# Altium project bailey-x.PrjPcb (part 8 of 8)
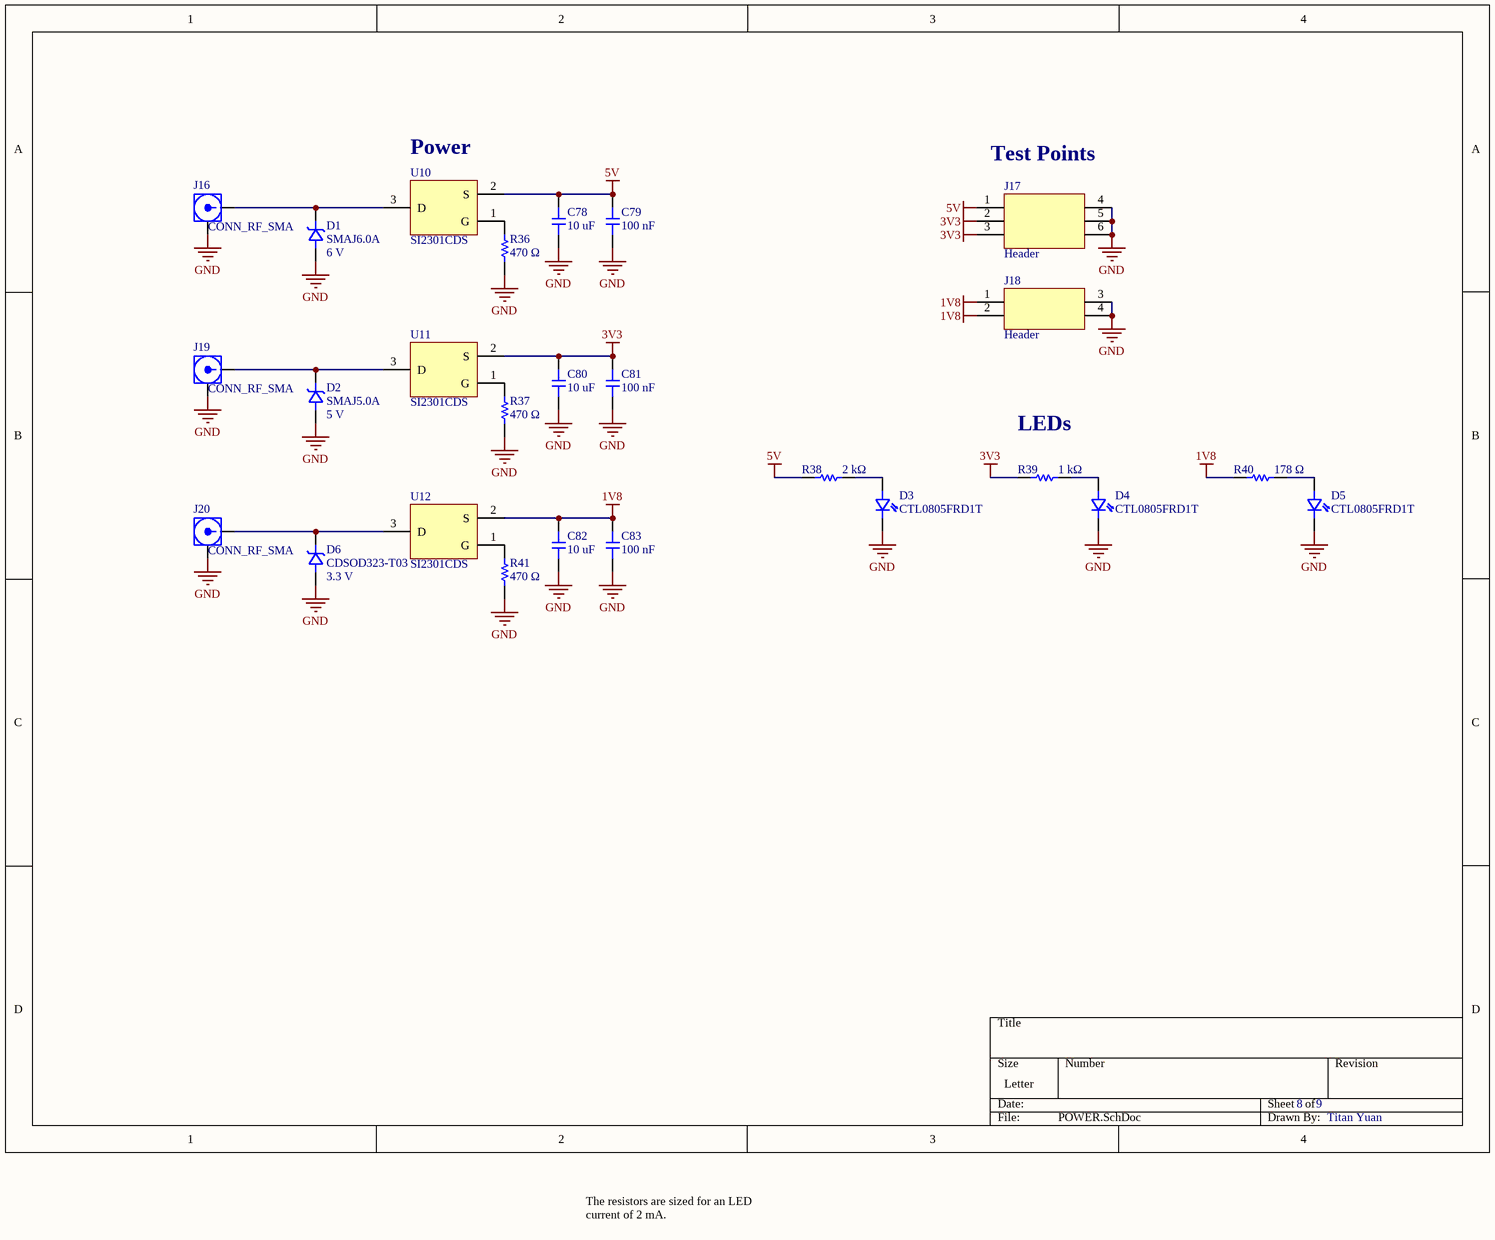
[diagram p14: POWER.SchDoc]

## Sheet POWER.SchDoc (continued)

### Library data of the parts (continued)
R39 = RES: 100mW Thick Film Resistors 75V ±100ppm/℃ ±1% 1kΩ 0603 Chip Resistor - Surface Mount ROHS; Manufacturer: Yageo; Manufacturer Part Number: RC0603FR-071KL; Temperature Coefficient: 100ppm/°C; Voltage Rating: 50V; Tolerance: 1%; Power Rating: *; Package Size: 0603; Supplier: DigiKey; Supplier Part Number: 311-1.00KHRCT-ND; RoHS: Compliant; Category: Chip SMD Resistors; Stock: 5944272; Pricing: 1=0.1, 10=0.008, 25=0.0076, 50=0.0072, 100=0.0061, 250=0.00568, 1000=0.00569, 5000=0.00204 (USD); Case/Package: 0603; Case Code (Imperial): 0603; Case Code (Metric): 0603; China RoHS: Non-Compliant; Composition: Thick Film; Contact Plating: Tin; Country of Origin: Mainland China, Taiwan; Depth: 800µm; Export Control Classification Number (ECCN) Code: EAR99; Height: 450µm; Harmonized Tariff Schedule (HTS) Code: 8533.21.00.30; Introduction Date: 2004-10-04; Lead Free: Lead Free; Length: 1.6mm; Lifecycle Status: Production; Max Operating Temperature: 155°C; Military Standard: Not; Min Operating Temperature: -55°C; Mounting Technology: Surface Mount; Pins: 2; Number of Terminals: 2; Packaging: Tape and Reel; Power Dissipation: 100mW; Radiation Hardening: No; REACH SVHC: Yes; Value: 1kΩ; Schedule B: 8533210045, 8533210045|8533210045|8533210045|8533210045|8533210045|8533210045|8533210045|8533210045|8533210045|8533210045|8533210045|8533210045|8533210045|8533210045|8533210045|8533210045|8533210045|8533210045|8533210045|8533210045|8533210045|8533210045|8533210045|85; Termination: SMD/SMT; Voltage Rating (DC): 50V; Width: 800µm; Working Voltage: 75V; ComponentLink1URL: https://datasheet.octopart.com:443/RC0603FR-071KL-Yageo-datasheet-175887523.pdf?src-supplier=Newark; ComponentLink1Description: https://datasheet.octopart.com:443/RC0603FR-071KL-Yageo-datasheet-175887523.pdf?src-supplier=Newark; ComponentLink2URL: https://datasheet.octopart.com:443/RC0603FR-071KL-Yageo-datasheet-34211833.pdf?src-supplier=Newark; ComponentLink2Description: https://datasheet.octopart.com:443/RC0603FR-071KL-Yageo-datasheet-34211833.pdf?src-supplier=Newark; ComponentLink3URL: https://datasheet.octopart.com:443/RC0603FR-071KL-Yageo-datasheet-12596169.pdf?src-supplier=Newark; ComponentLink3Description: https://datasheet.octopart.com:443/RC0603FR-071KL-Yageo-datasheet-12596169.pdf?src-supplier=Newark; ComponentLink4URL: https://datasheet.octopart.com:443/RC0603FR-071KL-Yageo-datasheet-499455.pdf?src-supplier=Newark; ComponentLink4Description: https://datasheet.octopart.com:443/RC0603FR-071KL-Yageo-datasheet-499455.pdf?src-supplier=Newark; ComponentLink5URL: https://datasheet.octopart.com:443/RC0603FR-071KL-Yageo-datasheet-503470.pdf?src-supplier=Newark; ComponentLink5Description: https://datasheet.octopart.com:443/RC0603FR-071KL-Yageo-datasheet-503470.pdf?src-supplier=Newark; ComponentLink6URL: https://datasheet.octopart.com:443/RC0603FR-071KL-Yageo-datasheet-62067350.pdf?src-supplier=element14+APAC; ComponentLink6Description: https://datasheet.octopart.com:443/RC0603FR-071KL-Yageo-datasheet-62067350.pdf?src-supplier=element14+APAC; ComponentLink7URL: https://datasheet.octopart.com:443/RC0603FR-071KL-Yageo-datasheet-21426514.pdf?src-supplier=element14+APAC; ComponentLink7Description: https://datasheet.octopart.com:443/RC0603FR-071KL-Yageo-datasheet-21426514.pdf?src-supplier=element14+APAC; ComponentLink8URL: https://datasheet.octopart.com:443/RC0603FR-071KL-Yageo-datasheet-141265859.pdf?src-supplier=Upverter; ComponentLink8Description: https://datasheet.octopart.com:443/RC0603FR-071KL-Yageo-datasheet-141265859.pdf?src-supplier=Upverter; ComponentLink9URL: https://datasheet.octopart.com:443/RC0603FR-071KL-Yageo-datasheet-103092701.pdf?src-supplier=Upverter; ComponentLink9Description: https://datasheet.octopart.com:443/RC0603FR-071KL-Yageo-datasheet-103092701.pdf?src-supplier=Upverter; ComponentLink10URL: https://sigma.octopart.com:443/138820526/technical_drawing/Yageo-RC0603FR-071KL.pdf?src-supplier=Upverter; ComponentLink10Description: https://sigma.octopart.com:443/138820526/technical_drawing/Yageo-RC0603FR-071KL.pdf?src-supplier=Upverter; ComponentLink11URL: https://datasheet.octopart.com:443/RC0603FR-071KL-Yageo-datasheet-68297981.pdf?src-supplier=Upverter; ComponentLink11Description: https://datasheet.octopart.com:443/RC0603FR-071KL-Yageo-datasheet-68297981.pdf?src-supplier=Upverter; ComponentLink12URL: https://datasheet.octopart.com:443/RC0603FR-071KL-Yageo-datasheet-8328172.pdf?src-supplier=Farnell; ComponentLink12Description: https://datasheet.octopart.com:443/RC0603FR-071KL-Yageo-datasheet-8328172.pdf?src-supplier=Farnell; ComponentLink13URL: https://datasheet.octopart.com:443/RC0603FR-071KL-Yageo-datasheet-13691069.pdf?src-supplier=Farnell; ComponentLink13Description: https://datasheet.octopart.com:443/RC0603FR-071KL-Yageo-datasheet-13691069.pdf?src-supplier=Farnell; ComponentLink14URL: https://datasheet.octopart.com:443/RC0603FR-071KL-Yageo-datasheet-15599030.pdf?src-supplier=Seeed+Studio; ComponentLink14Description: https://datasheet.octopart.com:443/RC0603FR-071KL-Yageo-datasheet-15599030.pdf?src-supplier=Seeed+Studio; ComponentLink15URL: https://datasheet.octopart.com:443/RC0603FR-071KL-Yageo-Group-datasheet-176638170.pdf?src-supplier=Future+Electronics; ComponentLink15Description: https://datasheet.octopart.com:443/RC0603FR-071KL-Yageo-Group-datasheet-176638170.pdf?src-supplier=Future+Electronics; ComponentLink16URL: https://datasheet.octopart.com:443/RC0603FR-071KL-Yageo-datasheet-164759695.pdf?src-supplier=Future+Electronics; ComponentLink16Description: https://datasheet.octopart.com:443/RC0603FR-071KL-Yageo-datasheet-164759695.pdf?src-supplier=Future+Electronics; ComponentLink17URL: https://datasheet.octopart.com:443/RC0603FR-071KL-Yageo-datasheet-137700087.pdf?src-supplier=Future+Electronics; ComponentLink17Description: https://datasheet.octopart.com:443/RC0603FR-071KL-Yageo-datasheet-137700087.pdf?src-supplier=Future+Electronics; ComponentLink18URL: https://datasheet.octopart.com:443/RC0603FR071KL-Yageo-datasheet-27584510.pdf?src-supplier=Future+Electronics; ComponentLink18Description: https://datasheet.octopart.com:443/RC0603FR071KL-Yageo-datasheet-27584510.pdf?src-supplier=Future+Electronics; ComponentLink19URL: https://datasheet.octopart.com:443/RC0603FR-071KL-Yageo-datasheet-8324193.pdf?src-supplier=Future+Electronics; ComponentLink19Description: https://datasheet.octopart.com:443/RC0603FR-071KL-Yageo-datasheet-8324193.pdf?src-supplier=Future+Electronics; ComponentLink20URL: https://datasheet.octopart.com:443/RC0603FR-071KL-Yageo-datasheet-79472498.pdf?src-supplier=Megastar; ComponentLink20Description: https://datasheet.octopart.com:443/RC0603FR-071KL-Yageo-datasheet-79472498.pdf?src-supplier=Megastar; ComponentLink21URL: https://datasheet.octopart.com/RC0603FR-071KL-Yageo-datasheet-73766026.pdf; ComponentLink21Description: https://datasheet.octopart.com/RC0603FR-071KL-Yageo-datasheet-73766026.pdf; ComponentLink22URL: https://datasheet.octopart.com:443/RC0603FR-071KL-Yageo-datasheet-118562.pdf?src-supplier=DigiKey; ComponentLink22Description: https://datasheet.octopart.com:443/RC0603FR-071KL-Yageo-datasheet-118562.pdf?src-supplier=DigiKey; ComponentLink23URL: http://sigma.octopart.com:80/conflict_mineral_statement/Yageo-company-3.pdf?src-supplier=Compliance+Statements; ComponentLink23Description: http://sigma.octopart.com:80/conflict_mineral_statement/Yageo-company-3.pdf?src-supplier=Compliance+Statements; ComponentLink24URL: http://sigma.octopart.com:80/rohs_statement/Yageo-company-2.pdf?src-supplier=Compliance+Statements; ComponentLink24Description: http://sigma.octopart.com:80/rohs_statement/Yageo-company-2.pdf?src-supplier=Compliance+Statements
R40 = RES: Res Thick Film 0603 178 Ohm 1% 0.1W(1/10W) ±100ppm/C Pad SMD T/R; Manufacturer: Yageo; Manufacturer Part Number: RC0603FR-07178RL; Power Dissipation: 100mW; Value: 178Ω; Temperature Coefficient: 100ppm/°C; Voltage Rating: 75V; Voltage Rating (DC): 50V; Tolerance: 1%; Power Rating: *; Package Size: 0603; Supplier: DigiKey; Supplier Part Number: 311-178HRCT-ND; RoHS: Compliant; Category: Chip SMD Resistors; Stock: 269039; Pricing: 1=0.1, 10=0.006, 25=0.0056, 50=0.0052 (USD); Case/Package: 0603; Case Code (Imperial): 0603; China RoHS: Non-Compliant; Composition: Thick Film; Depth: 800µm; Height: 450µm; Lead Free: Lead Free; Length: 1.6mm; Lifecycle Status: Production; Max Operating Temperature: 155°C; Military Standard: Not; Min Operating Temperature: -55°C; Mounting Technology: Surface Mount; Number of Terminals: 2; Packaging: Tape & Reel; REACH SVHC: Yes; Schedule B: 8533210045, 8533210045|8533210045|8533210045|8533210045|8533210045; Termination: SMD/SMT; Width: 800µm; Working Voltage: 75V; ComponentLink1URL: https://datasheet.octopart.com:443/RC0603FR-07178RL-Yageo-datasheet-175887523.pdf?src-supplier=Newark; ComponentLink1Description: https://datasheet.octopart.com:443/RC0603FR-07178RL-Yageo-datasheet-175887523.pdf?src-supplier=Newark; ComponentLink2URL: https://datasheet.octopart.com:443/RC0603FR-07178RL-Yageo-datasheet-103092701.pdf?src-supplier=Upverter; ComponentLink2Description: https://datasheet.octopart.com:443/RC0603FR-07178RL-Yageo-datasheet-103092701.pdf?src-supplier=Upverter; ComponentLink3URL: https://datasheet.octopart.com:443/RC0603FR-07178RL-Yageo-Group-datasheet-176638170.pdf?src-supplier=Future+Electronics; ComponentLink3Description: https://datasheet.octopart.com:443/RC0603FR-07178RL-Yageo-Group-datasheet-176638170.pdf?src-supplier=Future+Electronics; ComponentLink4URL: https://datasheet.octopart.com:443/RC0603FR-07178RL-Yageo-datasheet-164759695.pdf?src-supplier=Future+Electronics; ComponentLink4Description: https://datasheet.octopart.com:443/RC0603FR-07178RL-Yageo-datasheet-164759695.pdf?src-supplier=Future+Electronics; ComponentLink5URL: https://datasheet.octopart.com:443/RC0603FR-07178RL-Yageo-datasheet-137700087.pdf?src-supplier=Future+Electronics; ComponentLink5Description: https://datasheet.octopart.com:443/RC0603FR-07178RL-Yageo-datasheet-137700087.pdf?src-supplier=Future+Electronics; ComponentLink6URL: https://datasheet.octopart.com:443/RC0603FR-07178RL-Yageo-datasheet-101672632.pdf?src-supplier=Future+Electronics; ComponentLink6Description: https://datasheet.octopart.com:443/RC0603FR-07178RL-Yageo-datasheet-101672632.pdf?src-supplier=Future+Electronics; ComponentLink7URL: https://datasheet.octopart.com:443/RC0603FR-07178RL-Yageo-datasheet-15599030.pdf?src-supplier=Future+Electronics; ComponentLink7Description: https://datasheet.octopart.com:443/RC0603FR-07178RL-Yageo-datasheet-15599030.pdf?src-supplier=Future+Electronics; ComponentLink8URL: https://datasheet.octopart.com:443/RC0603FR-07178RL-Yageo-datasheet-12596169.pdf?src-supplier=Future+Electronics; ComponentLink8Description: https://datasheet.octopart.com:443/RC0603FR-07178RL-Yageo-datasheet-12596169.pdf?src-supplier=Future+Electronics; ComponentLink9URL: https://datasheet.octopart.com:443/RC0603FR-07178RL-Yageo-datasheet-8328172.pdf?src-supplier=Future+Electronics; ComponentLink9Description: https://datasheet.octopart.com:443/RC0603FR-07178RL-Yageo-datasheet-8328172.pdf?src-supplier=Future+Electronics; ComponentLink10URL: https://datasheet.octopart.com:443/RC0603FR-07178RL-Yageo-datasheet-148775077.pdf?src-supplier=TME; ComponentLink10Description: https://datasheet.octopart.com:443/RC0603FR-07178RL-Yageo-datasheet-148775077.pdf?src-supplier=TME; ComponentLink11URL: https://datasheet.octopart.com/RC0603FR-07178RL-Yageo-datasheet-73766026.pdf; ComponentLink11Description: https://datasheet.octopart.com/RC0603FR-07178RL-Yageo-datasheet-73766026.pdf; ComponentLink12URL: https://datasheet.octopart.com:443/RC0603FR-07178RL-Yageo-datasheet-118562.pdf?src-supplier=DigiKey; ComponentLink12Description: https://datasheet.octopart.com:443/RC0603FR-07178RL-Yageo-datasheet-118562.pdf?src-supplier=DigiKey; ComponentLink13URL: http://sigma.octopart.com:80/conflict_mineral_statement/Yageo-company-3.pdf?src-supplier=Compliance+Statements; ComponentLink13Description: http://sigma.octopart.com:80/conflict_mineral_statement/Yageo-company-3.pdf?src-supplier=Compliance+Statements; ComponentLink14URL: http://sigma.octopart.com:80/rohs_statement/Yageo-company-2.pdf?src-supplier=Compliance+Statements; ComponentLink14Description: http://sigma.octopart.com:80/rohs_statement/Yageo-company-2.pdf?src-supplier=Compliance+Statements
U10-U12 = SI2301CDS: P-ch Mosfet SOT-23 20V 112MOHM @ 4.5V - Lead(pb) And Halogen Free; Manufacturer: Vishay Siliconix; Manufacturer Part Number: SI2301CDS-T1-GE3; Continuous Drain Current (ID): 3.1A; Drain to Source Breakdown Voltage: -20V; Drain to Source Resistance: 112mΩ; Element Configuration: Single; Fall Time: 35ns; Gate to Source Voltage (Vgs): 8V; Input Capacitance: 405pF; Max Junction Temperature (Tj): 150°C; Max Power Dissipation: 1.6W; Nominal Vgs: -400mV; Number of Channels: 1; Value: 112mΩ; Threshold Voltage: -1V; Turn-Off Delay Time: 30ns; Turn-On Delay Time: 11ns; Supplier: DigiKey; Supplier Part Number: SI2301CDS-T1-GE3CT-ND; RoHS: Compliant; Category: MOSFETs; Stock: 103168; Pricing: 1=0.69, 10=0.425, 100=0.2731, 500=0.20736, 1000=0.18615, 3000=0.15917, 6000=0.14558, 9000=0.13865, 15000=0.13086, 21000=0.12625, 30000=0.12177, 75000=0.11875 (USD); Case/Package: SOT-23; China RoHS: Compliant; Contact Plating: Tin; Country of Origin: Mainland China; Drain to Source Voltage (Vdss): -20V; Export Control Classification Number (ECCN) Code: EAR99; Height: 1.12mm; Introduction Date: 2008-07-29; Lead Free: Lead Free; Length: 3.04mm; Lifecycle Status: NRND; Max Operating Temperature: 150°C; Min Breakdown Voltage: 20V; Min Operating Temperature: -55°C; Mounting Technology: Surface Mount; Number of Elements: 1; Pins: 3; Number of Terminals: 3; Packaging: Cut Tape; Power Dissipation: 1.6W; Radiation Hardening: No; Rds On Max: 112mΩ; REACH SVHC: Yes; Rise Time: 35ns; Schedule B: 8541210080, 8541210080|8541210080, 8541210080|8541210080|8541210080, 8541210080|8541210080|8541210080|8541210080; Weight: 1.437803g; Width: 1.4mm; ComponentLink1URL: https://datasheet.octopart.com:443/SI2301CDS-T1-GE3-Vishay-datasheet-181471154.pdf?src-supplier=Newark; ComponentLink1Description: https://datasheet.octopart.com:443/SI2301CDS-T1-GE3-Vishay-datasheet-181471154.pdf?src-supplier=Newark; ComponentLink2URL: https://datasheet.octopart.com:443/SI2301CDS-T1-GE3-Vishay-datasheet-12510940.pdf?src-supplier=Newark; ComponentLink2Description: https://datasheet.octopart.com:443/SI2301CDS-T1-GE3-Vishay-datasheet-12510940.pdf?src-supplier=Newark; ComponentLink3URL: https://datasheet.octopart.com:443/SI2301CDS-T1-GE3-Vishay-datasheet-8434571.pdf?src-supplier=Newark; ComponentLink3Description: https://datasheet.octopart.com:443/SI2301CDS-T1-GE3-Vishay-datasheet-8434571.pdf?src-supplier=Newark; ComponentLink4URL: https://datasheet.octopart.com:443/SI2301CDS-T1-GE3-Vishay-datasheet-41341312.pdf?src-supplier=Newark; ComponentLink4Description: https://datasheet.octopart.com:443/SI2301CDS-T1-GE3-Vishay-datasheet-41341312.pdf?src-supplier=Newark; ComponentLink5URL: https://datasheet.octopart.com:443/SI2301CDS-T1-GE3-Vishay-datasheet-62318581.pdf?src-supplier=element14+APAC; ComponentLink5Description: https://datasheet.octopart.com:443/SI2301CDS-T1-GE3-Vishay-datasheet-62318581.pdf?src-supplier=element14+APAC; ComponentLink6URL: https://datasheet.octopart.com:443/SI2301CDS-T1-GE3-Vishay-datasheet-41195220.pdf?src-supplier=element14+APAC; ComponentLink6Description: https://datasheet.octopart.com:443/SI2301CDS-T1-GE3-Vishay-datasheet-41195220.pdf?src-supplier=element14+APAC; ComponentLink7URL: https://datasheet.octopart.com:443/SI2301CDS-T1-GE3.-Vishay-datasheet-78863653.pdf?src-supplier=element14+APAC; ComponentLink7Description: https://datasheet.octopart.com:443/SI2301CDS-T1-GE3.-Vishay-datasheet-78863653.pdf?src-supplier=element14+APAC; ComponentLink8URL: https://datasheet.octopart.com:443/SI2301CDS-T1-GE3-Vishay-datasheet-21269440.pdf?src-supplier=Farnell; ComponentLink8Description: https://datasheet.octopart.com:443/SI2301CDS-T1-GE3-Vishay-datasheet-21269440.pdf?src-supplier=Farnell; ComponentLink9URL: https://datasheet.octopart.com:443/SI2301CDS-T1-GE3-Vishay-datasheet-165585106.pdf?src-supplier=TME; ComponentLink9Description: https://datasheet.octopart.com:443/SI2301CDS-T1-GE3-Vishay-datasheet-165585106.pdf?src-supplier=TME; ComponentLink10URL: https://datasheet.octopart.com:443/SI2301CDS-T1-GE3-Vishay-datasheet-44060305.pdf?src-supplier=TME; ComponentLink10Description: https://datasheet.octopart.com:443/SI2301CDS-T1-GE3-Vishay-datasheet-44060305.pdf?src-supplier=TME; ComponentLink11URL: https://datasheet.octopart.com:443/SI2301CDS-T1-GE3-Vishay-Siliconix-datasheet-62309529.pdf?src-supplier=RS+(Formerly+Allied+Electronics); ComponentLink11Description: https://datasheet.octopart.com:443/SI2301CDS-T1-GE3-Vishay-Siliconix-datasheet-62309529.pdf?src-supplier=RS+(Formerly+Allied+Electronics); ComponentLink12URL: https://datasheet.octopart.com:443/SI2301CDS-T1-GE3-Vishay-datasheet-14188513.pdf?src-supplier=iiiC; ComponentLink12Description: https://datasheet.octopart.com:443/SI2301CDS-T1-GE3-Vishay-datasheet-14188513.pdf?src-supplier=iiiC; ComponentLink13URL: http://sigma.octopart.com:80/rohs_statement/Vishay-company-15.pdf?src-supplier=Compliance+Statements; ComponentLink13Description: http://sigma.octopart.com:80/rohs_statement/Vishay-company-15.pdf?src-supplier=Compliance+Statements

## Sheet MCU.SchDoc
size Letter; DrawnBy: Titan Yuan; SheetNumber: 9; SheetTotal: 9
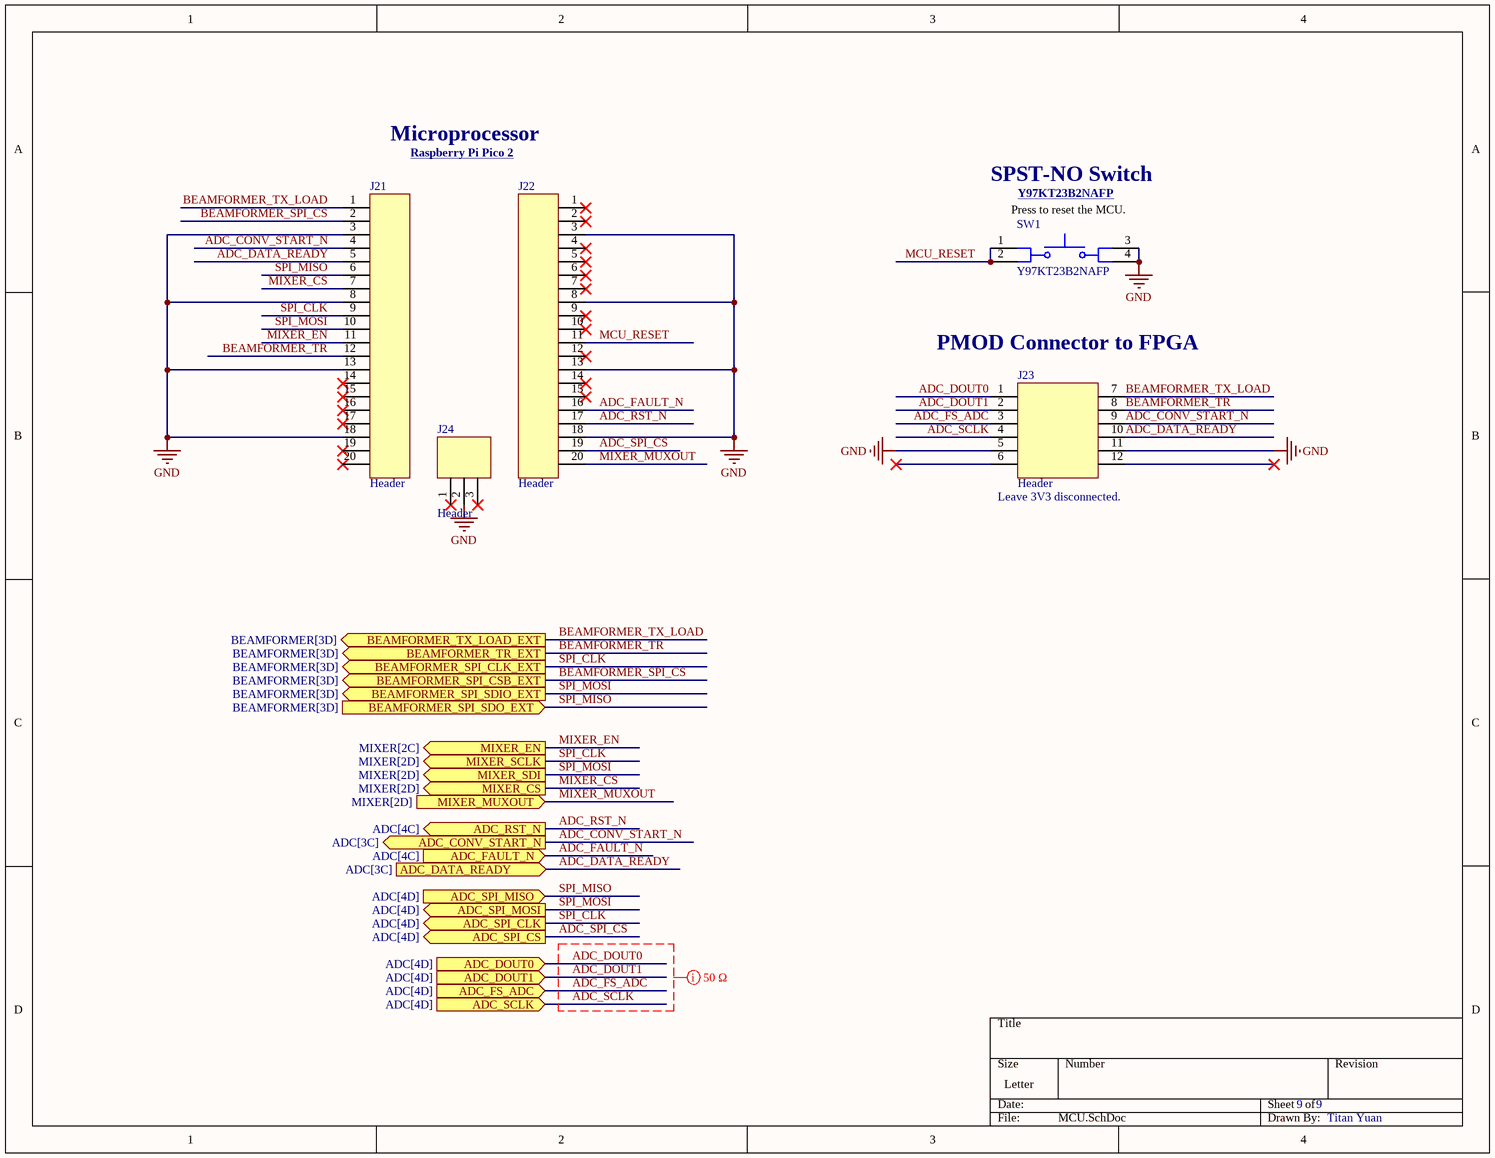
[diagram p8: MCU.SchDoc]

### Parts
J21  Header  [CONN_1x20_2.54mm_PinSocket_Vertical]
J22  Header  [CONN_1x20_2.54mm_PinSocket_Vertical]
J23  Header  [CONN_2x6_2.54mm_PinHeader_Horizontal]
J24  Header  [CONN_1x3_2.54mm_PinSocket_Vertical]
SW1  Y97KT23B2NAFP  [PTS647]

### Ports
ADC_CONV_START_N (out, see ADC[3C]), ADC_DATA_READY (in, see ADC[3C]), ADC_DOUT0 (in, see ADC[4D]), ADC_DOUT1 (in, see ADC[4D]), ADC_FAULT_N (in, see ADC[4C]), ADC_FS_ADC (in, see ADC[4D]), ADC_RST_N (out, see ADC[4C]), ADC_SCLK (in, see ADC[4D]), ADC_SPI_CLK (out, see ADC[4D]), ADC_SPI_CS (out, see ADC[4D]), ADC_SPI_MISO (in, see ADC[4D]), ADC_SPI_MOSI (out, see ADC[4D]), BEAMFORMER_SPI_CLK_EXT (out, see BEAMFORMER[3D]), BEAMFORMER_SPI_CSB_EXT (out, see BEAMFORMER[3D]), BEAMFORMER_SPI_SDIO_EXT (out, see BEAMFORMER[3D]), BEAMFORMER_SPI_SDO_EXT (in, see BEAMFORMER[3D]), BEAMFORMER_TR_EXT (out, see BEAMFORMER[3D]), BEAMFORMER_TX_LOAD_EXT (out, see BEAMFORMER[3D]), MIXER_CS (out, see MIXER[2D]), MIXER_EN (out, see MIXER[2C]), MIXER_MUXOUT (in, see MIXER[2D]), MIXER_SCLK (out, see MIXER[2D]), MIXER_SDI (out, see MIXER[2D])

### Nets
GND: J21.3 J21.8 J21.13 J21.18 J22.3 J22.8 J22.13 J22.18 J23.5 J23.11 J24.2 SW1.3 SW1.4
ADC_CONV_START_N: J21.4 J23.9 ; port ADC_CONV_START_N
ADC_DATA_READY: J21.5 J23.10 ; port ADC_DATA_READY
ADC_DOUT0: J23.1 ; port ADC_DOUT0
ADC_DOUT1: J23.2 ; port ADC_DOUT1
ADC_FAULT_N: J22.16 ; port ADC_FAULT_N
ADC_FS_ADC: J23.3 ; port ADC_FS_ADC
ADC_RST_N: J22.17 ; port ADC_RST_N
ADC_SCLK: J23.4 ; port ADC_SCLK
ADC_SPI_CS: J22.19 ; port ADC_SPI_CS
BEAMFORMER_SPI_CS: J21.2 ; port BEAMFORMER_SPI_CSB_EXT
BEAMFORMER_TR: J21.12 J23.8 ; port BEAMFORMER_TR_EXT
BEAMFORMER_TX_LOAD: J21.1 J23.7 ; port BEAMFORMER_TX_LOAD_EXT
MCU_RESET: J22.11 SW1.1 SW1.2  [project net MCU_RESET_9]
MIXER_CS: J21.7 ; port MIXER_CS
MIXER_EN: J21.11 ; port MIXER_EN
MIXER_MUXOUT: J22.20 ; port MIXER_MUXOUT
SPI_CLK: J21.9 ; port ADC_SPI_CLK, port MIXER_SCLK, port BEAMFORMER_SPI_CLK_EXT  [project net ADC_SPI_CLK]
SPI_MISO: J21.6 ; port ADC_SPI_MISO, port BEAMFORMER_SPI_SDO_EXT  [project net ADC_SPI_MISO]
SPI_MOSI: J21.10 ; port ADC_SPI_MOSI, port MIXER_SDI, port BEAMFORMER_SPI_SDIO_EXT  [project net ADC_SPI_MOSI]

Not connected (* = marked no-connect by the designer): J21 14* 15* 16* 17* 19* 20*; J22 1* 2* 4* 5* 6* 7* 9* 10* 12* 14* 15*; J23 6* 12*; J24 1* 3*

### Layout directives
net class 50 Ω: ADC_DOUT0, ADC_DOUT1, ADC_FS_ADC, ADC_SCLK

### Notes on the sheet
- Microprocessor
- Raspberry Pi Pico 2 <https://www.raspberrypi.com/products/raspberry-pi-pico-2/>
- SPST-NO Switch
- (near SW1) Press to reset the MCU.
- (near SW1) Y97KT23B2NAFP <https://www.ckswitches.com/media/2567/pts647.pdf>
- (near J23) PMOD Connector to FPGA
- (near J23) Leave 3V3 disconnected.

### Library data of the parts
J21 J22 = CONN_1x20_2.54mm_PinSocket_Vertical: WR-PHD 2.54 mm Socket Header; 20 pins; Manufacturer: Wurth Elektronik; Manufacturer Part Number: 61302011821; Contact Resistance: 20mΩ; Current Rating: 3A; Gender: Female; Insulation Resistance: 1GΩ; Operating Supply Voltage: 250V; Pitch: 2.54mm; Supplier: DigiKey; Supplier Part Number: 732-61302011821-ND; RoHS: Compliant; Category: Connectors; Stock: 9205; Pricing: 1=0.83, 25=0.7508, 100=0.7038, 250=0.6534, 500=0.6048, 1000=0.5058 (USD); Contact Plating: Gold; Insulation Material: PBT; Lead Pitch: 2.54mm; Length: 51.3mm; Max Operating Temperature: 105°C; Min Operating Temperature: -40°C; Pins: 20; Orientation: Vertical; ComponentLink1URL: https://datasheet.octopart.com:443/61302011821-Wurth-Elektronik-datasheet-182028588.pdf?src-supplier=Wurth+Elektronik; ComponentLink1Description: https://datasheet.octopart.com:443/61302011821-Wurth-Elektronik-datasheet-182028588.pdf?src-supplier=Wurth+Elektronik; ComponentLink2URL: https://datasheet.octopart.com:443/61302011821-W%C3%BCrth-Elektronik-datasheet-62127820.pdf?src-supplier=Wurth+Elektronik; ComponentLink2Description: https://datasheet.octopart.com:443/61302011821-W%C3%BCrth-Elektronik-datasheet-62127820.pdf?src-supplier=Wurth+Elektronik; ComponentLink3URL: https://datasheet.octopart.com:443/61302011821-W%C3%BCrth-Elektronik-datasheet-149524182.pdf?src-supplier=Farnell; ComponentLink3Description: https://datasheet.octopart.com:443/61302011821-W%C3%BCrth-Elektronik-datasheet-149524182.pdf?src-supplier=Farnell
J23 = CONN_2x6_2.54mm_PinHeader_Horizontal: Conn Unshrouded Header HDR 12 POS 2.54mm Solder RA Top Entry Thru-Hole Bag; Manufacturer: Adam Tech; Manufacturer Part Number: PH2RA-12-UA; Contact Resistance: 20mΩ; Current Rating: 3A; Insulation Resistance: 5GΩ; Supplier: DigiKey; Supplier Part Number: 2057-PH2RA-12-UA-ND; RoHS: Compliant; Category: Card Edge Connectors; Stock: 5214; Pricing: 1=0.27, 10=0.229, 100=0.1945, 500=0.17358, 1000=0.16528, 5000=0.14753, 10000=0.14049 (USD); Contact Gender: Male; Contact Material: Brass; Export Control Classification Number (ECCN) Code: EAR99; Harmonized Tariff Schedule (HTS) Code: 8536.69.40.40; Introduction Date: 2012-01-13; Lifecycle Status: Production; Max Operating Temperature: 105°C; Min Operating Temperature: -40°C; Pins: 12; Number of Rows: 2; REACH SVHC: Yes; Row Spacing: 2.54mm; Schedule B: 8536694040, 8536694040|8536694040|8536694040|8536694040|8536694040; Terminal Pitch: 2.54mm; ComponentLink1URL: https://datasheet.octopart.com:443/PH2RA-12-UA-Adam-Tech-datasheet-21182894.pdf?src-supplier=IHS; ComponentLink1Description: https://datasheet.octopart.com:443/PH2RA-12-UA-Adam-Tech-datasheet-21182894.pdf?src-supplier=IHS; ComponentLink2URL: http://sigma.octopart.com:80/reach_statement/Adam-Tech-company-23.pdf?src-supplier=Compliance+Statements; ComponentLink2Description: http://sigma.octopart.com:80/reach_statement/Adam-Tech-company-23.pdf?src-supplier=Compliance+Statements; ComponentLink3URL: http://sigma.octopart.com:80/rohs_statement/Adam-Tech-company-22.pdf?src-supplier=Compliance+Statements; ComponentLink3Description: http://sigma.octopart.com:80/rohs_statement/Adam-Tech-company-22.pdf?src-supplier=Compliance+Statements
J24 = CONN_1x3_2.54mm_PinSocket_Vertical: Connector Header Through Hole 3 position 0.100" (2.54mm)-FAN Control Connector; Manufacturer: Wurth Elektronik; Manufacturer Part Number: 61300311821; Manufacturer Lifecycle Status: ACTIVE; Contact Resistance: 20mΩ; Current Rating: 3A; Gender: Female; Insulation Resistance: 1GΩ; Operating Supply Voltage: 250V; YEOL: 1 = Estimated lifetime > 10 years; Supplier: DigiKey; Supplier Part Number: 732-61300311821-ND; RoHS: Compliant; Category: Uncategorized; Stock: 1715; Pricing: 1=0.32, 10=0.303, 100=0.2916, 250=0.27992, 500=0.2673 (USD); Contact Plating: Gold; Insulation Material: PBT; Lead Pitch: 2.54mm; Length: 8.12mm; Max Operating Temperature: 105°C; Min Operating Temperature: -40°C; Pins: 3; Orientation: Vertical; Pitch: 2.54mm; ComponentLink1URL: https://datasheet.octopart.com:443/61300311821-Wurth-Elektronik-datasheet-182028583.pdf?src-supplier=Wurth+Elektronik; ComponentLink1Description: https://datasheet.octopart.com:443/61300311821-Wurth-Elektronik-datasheet-182028583.pdf?src-supplier=Wurth+Elektronik; ComponentLink2URL: https://datasheet.octopart.com:443/61300311821-W%C3%BCrth-Elektronik-datasheet-62127820.pdf?src-supplier=Wurth+Elektronik; ComponentLink2Description: https://datasheet.octopart.com:443/61300311821-W%C3%BCrth-Elektronik-datasheet-62127820.pdf?src-supplier=Wurth+Elektronik; Lifecycle Status: Production
SW1 = Y97KT23B2NAFP: Switch Tactile OFF Mom SPST Round Button Gull Wing 50mA 12VDC 100000Cycles 1.77N Surface Mount T/R; Manufacturer: C&K; Bounce Time: <=5 ms; Contact Resistance: 100 mΩ; Electrical Life: 100kcycles; Max Voltage Rating (DC): 12V; Number of Positions: 1; Operating Force: 2.26N; Manufacturer Part Number: Y97KT23B2NAFP; Maximum Voltage: 12 VDC; Maximum Current: 50 mA; Insulation Resistance: 100 MΩ; Supplier: DigiKey; Supplier Part Number: 108-PTS647SM38SMTR2LFSCT-ND; RoHS: Compliant; Category: Tactile Switches; Stock: 37245; Pricing: 1=0.26, 10=0.226, 25=0.2116, 100=0.1897, 250=0.17588, 500=0.16596, 1000=0.15666 (USD); Contact Current Rating: 50mA; Country of Origin: Mainland China; Export Control Classification Number (ECCN) Code: EAR99; Height: 2.9mm; Harmonized Tariff Schedule (HTS) Code: 8536.50.90.40; Introduction Date: 2019-06-11; Length: 4.5mm; Life (Cycles): 100kcycles; Lifecycle Status: Production; Max Current Rating: 50mA; Max Operating Temperature: 70°C; Min Operating Temperature: -40°C; Mounting Technology: Surface Mount; REACH SVHC: Yes; Schedule B: 8536509065, 8536509065|8536509065, 8536509065|8536509065|8536509065, 8536509065|8536509065|8536509065|8536509065; Throw Configuration: SPST; Voltage Rating (DC): 12V; ComponentLink1URL: https://datasheet.octopart.com:443/PTS647SM38SMTR2LFS-C%26K-Components-datasheet-180017464.pdf?src-supplier=IHS; ComponentLink1Description: https://datasheet.octopart.com:443/PTS647SM38SMTR2LFS-C%26K-Components-datasheet-180017464.pdf?src-supplier=IHS; ComponentLink2URL: https://datasheet.octopart.com:443/PTS647SM38SMTR2LFS-C%26K-Components-datasheet-117317067.pdf?src-supplier=Future+Electronics; ComponentLink2Description: https://datasheet.octopart.com:443/PTS647SM38SMTR2LFS-C%26K-Components-datasheet-117317067.pdf?src-supplier=Future+Electronics; ComponentLink3URL: https://datasheet.octopart.com:443/PTS647SM38SMTR2-LFS-C%26K-Components-datasheet-175422368.pdf?src-supplier=Farnell; ComponentLink3Description: https://datasheet.octopart.com:443/PTS647SM38SMTR2-LFS-C%26K-Components-datasheet-175422368.pdf?src-supplier=Farnell; ComponentLink4URL: https://datasheet.octopart.com:443/PTS647SM38SMTR2LFS-C%26K-Components-datasheet-145017121.pdf?src-supplier=Electro+Sonic; ComponentLink4Description: https://datasheet.octopart.com:443/PTS647SM38SMTR2LFS-C%26K-Components-datasheet-145017121.pdf?src-supplier=Electro+Sonic; ComponentLink5URL: https://datasheet.octopart.com:443/PTS-647-SM38-SMTR2-LFS-C%26K-Components-datasheet-119449707.pdf?src-supplier=RS+(Formerly+Allied+Electronics); ComponentLink5Description: https://datasheet.octopart.com:443/PTS-647-SM38-SMTR2-LFS-C%26K-Components-datasheet-119449707.pdf?src-supplier=RS+(Formerly+Allied+Electronics)

## Nets that join several sheets
1V8: BEAMFORMER (5 pins), POWER (6 pins)
3V3: BEAMFORMER (11 pins), MIXER (27 pins), IF (C40.2 U7.4), ADC (30 pins), OSC (C77.2 U9.1 U9.4), POWER (6 pins)
5V: LNA (C13.2 C14.2 U4.14 U4.16), MIXER (6 pins), POWER (5 pins)
GND: BEAMFORMER (88 pins), SPLITTER (33 pins), LNA (16 pins), MIXER (45 pins), IF (10 pins), ADC (41 pins), OSC (C77.1 J15.2 U9.2), POWER (23 pins), MCU (13 pins)
ADC_CONV_START_N: ADC (J14.1 R26.1 U8.35), MCU (J21.4 J23.9)
ADC_DATA_READY: ADC (J14.4 U8.22), MCU (J21.5 J23.10)
ADC_DOUT0: ADC (R23.2), MCU (J23.1)
ADC_DOUT1: ADC (R24.2), MCU (J23.2)
ADC_FAULT_N: ADC (J14.2 R27.1 U8.42), MCU (J22.16)
ADC_FS_ADC: ADC (R32.1), MCU (J23.3)
ADC_MCLKIN: ADC (U8.16), OSC (R34.2 R35.2)
ADC_RST_N: ADC (J14.3 R28.1 U8.43), MCU (J22.17)
ADC_SCLK: ADC (R25.2), MCU (J23.4)
ADC_SPI_CLK: BEAMFORMER (U2.16), MIXER (U5.24), ADC (U8.40), MCU (J21.9)
ADC_SPI_CS: ADC (R29.1 U8.41), MCU (J22.19)
ADC_SPI_MISO: BEAMFORMER (U2.13), ADC (U8.38), MCU (J21.6)
ADC_SPI_MOSI: BEAMFORMER (U2.14), MIXER (U5.25), ADC (U8.39), MCU (J21.10)
BEAMFORMER_SPI_CS: BEAMFORMER (U2.15), MCU (J21.2)
BEAMFORMER_TR: BEAMFORMER (U2.17), MCU (J21.12 J23.8)
BEAMFORMER_TX_LOAD: BEAMFORMER (U2.18), MCU (J21.1 J23.7)
IF_I_EXT_N: MIXER (R11.1), IF (U7.5), ADC (C73.1)
IF_I_EXT_P: MIXER (R12.1), IF (U7.3), ADC (C71.1)
IF_Q_EXT_N: MIXER (R13.1), IF (U7.10), ADC (C76.1)
IF_Q_EXT_P: MIXER (R14.1), IF (U7.12), ADC (C74.1)
LNA_OUT: LNA (U4.10), MIXER (C17.2)
LO_BEAMFORMER: BEAMFORMER (U1.A7), SPLITTER (U3.12)
LO_MIXER: SPLITTER (U3.29), MIXER (U6.2)
MIXER_CS: MIXER (R10.1 U5.26), MCU (J21.7)
MIXER_EN: MIXER (R9.1 U5.1), MCU (J21.11)
MIXER_MUXOUT: MIXER (U5.11), MCU (J22.20)